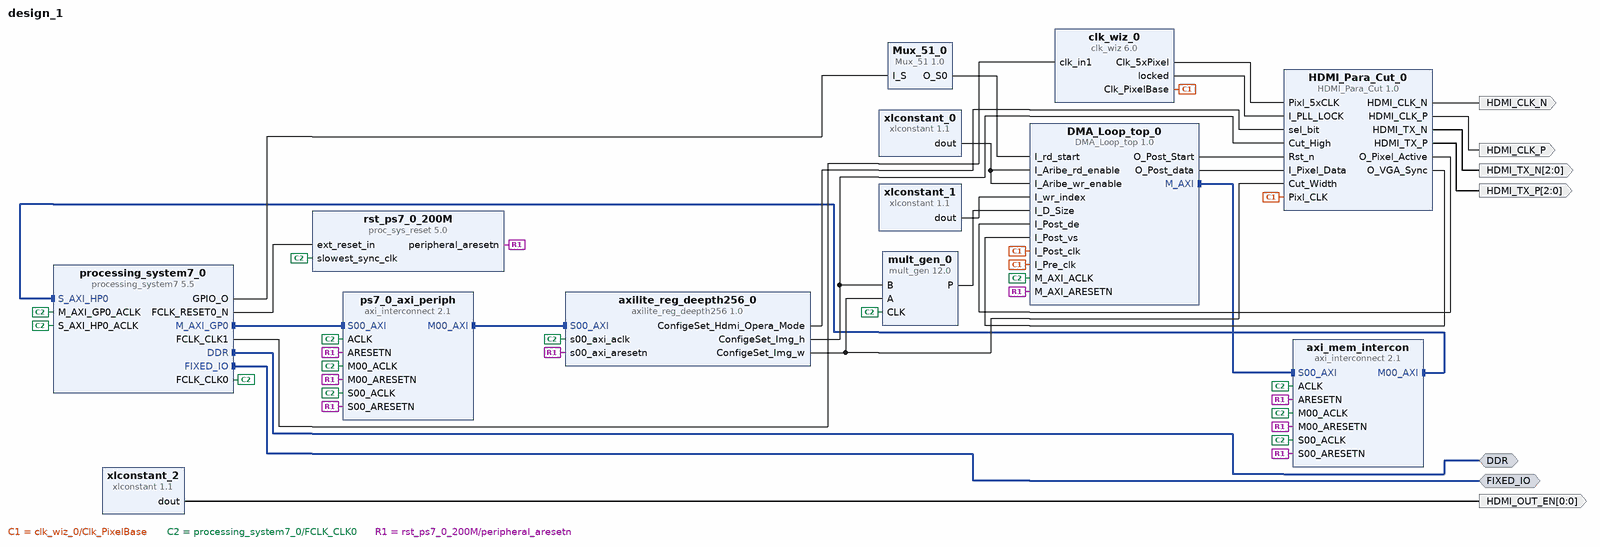
[diagram p0: block diagram of the top level]
# Vivado block design design_1, xc7z020clg400-1, Vivado 2023.2
create_bd_design design_1

create_bd_intf_port -mode Master -vlnv xilinx.com:interface:ddrx_rtl:1.0 DDR
create_bd_intf_port -mode Master -vlnv xilinx.com:display_processing_system7:fixedio_rtl:1.0 FIXED_IO
create_bd_port -dir O -type clk HDMI_CLK_P
create_bd_port -dir O -type clk HDMI_CLK_N
create_bd_port -dir O -from 2 -to 0 HDMI_TX_P
create_bd_port -dir O -from 2 -to 0 HDMI_TX_N
create_bd_port -dir O -from 0 -to 0 HDMI_OUT_EN

create_bd_cell -type ip -vlnv xilinx.com:ip:processing_system7:5.5 processing_system7_0
set_property -dict [list \
  CONFIG.PCW_ENET0_ENET0_IO {MIO 16 .. 27} \
  CONFIG.PCW_ENET0_GRP_MDIO_ENABLE 1 \
  CONFIG.PCW_ENET0_GRP_MDIO_IO {MIO 52 .. 53} \
  CONFIG.PCW_ENET0_PERIPHERAL_ENABLE 1 \
  CONFIG.PCW_EN_CLK1_PORT 1 \
  CONFIG.PCW_FCLK_CLK0_BUF FALSE \
  CONFIG.PCW_FCLK_CLK1_BUF TRUE \
  CONFIG.PCW_FPGA0_PERIPHERAL_FREQMHZ 150 \
  CONFIG.PCW_FPGA1_PERIPHERAL_FREQMHZ 100 \
  CONFIG.PCW_FPGA_FCLK1_ENABLE 1 \
  CONFIG.PCW_GPIO_EMIO_GPIO_ENABLE 1 \
  CONFIG.PCW_GPIO_EMIO_GPIO_IO 5 \
  CONFIG.PCW_GPIO_EMIO_GPIO_WIDTH 5 \
  CONFIG.PCW_PRESET_BANK1_VOLTAGE {LVCMOS 1.8V} \
  CONFIG.PCW_SD0_GRP_CD_ENABLE 0 \
  CONFIG.PCW_SD0_GRP_WP_ENABLE 0 \
  CONFIG.PCW_SD0_PERIPHERAL_ENABLE 1 \
  CONFIG.PCW_SD0_SD0_IO {MIO 40 .. 45} \
  CONFIG.PCW_SDIO_PERIPHERAL_FREQMHZ 100 \
  CONFIG.PCW_UART0_PERIPHERAL_ENABLE 1 \
  CONFIG.PCW_UART0_UART0_IO {MIO 46 .. 47} \
  CONFIG.PCW_UART_PERIPHERAL_FREQMHZ 100 \
  CONFIG.PCW_UIPARAM_DDR_PARTNO Custom \
  CONFIG.PCW_USE_S_AXI_HP0 1 \
] [get_bd_cells processing_system7_0]
# 127 more settings of processing_system7_0 are not shown: defaults, MIO pin electricals, DDR timing, and values the tool derives
create_bd_cell -type ip -vlnv xilinx.com:ip:axi_interconnect:2.1 ps7_0_axi_periph
set_property -dict {CONFIG.NUM_MI 1} [get_bd_cells ps7_0_axi_periph]
create_bd_cell -type ip -vlnv xilinx.com:ip:proc_sys_reset:5.0 rst_ps7_0_200M
create_bd_cell -type ip -vlnv xilinx.com:ip:xlconstant:1.1 xlconstant_0
create_bd_cell -type ip -vlnv xilinx.com:ip:clk_wiz:6.0 clk_wiz_0
set_property -dict [list \
  CONFIG.CLKOUT1_JITTER 221.150 \
  CONFIG.CLKOUT1_PHASE_ERROR 300.991 \
  CONFIG.CLKOUT1_REQUESTED_OUT_FREQ 108 \
  CONFIG.CLKOUT2_JITTER 178.209 \
  CONFIG.CLKOUT2_PHASE_ERROR 300.991 \
  CONFIG.CLKOUT2_REQUESTED_OUT_FREQ 540 \
  CONFIG.CLKOUT2_USED true \
  CONFIG.CLK_OUT1_PORT Clk_PixelBase \
  CONFIG.CLK_OUT2_PORT Clk_5xPixel \
  CONFIG.MMCM_CLKFBOUT_MULT_F 54.000 \
  CONFIG.MMCM_CLKOUT0_DIVIDE_F 10.000 \
  CONFIG.MMCM_CLKOUT1_DIVIDE 2 \
  CONFIG.MMCM_DIVCLK_DIVIDE 5 \
  CONFIG.NUM_OUT_CLKS 2 \
  CONFIG.PRIM_IN_FREQ 100.000 \
  CONFIG.USE_LOCKED true \
  CONFIG.USE_RESET false \
] [get_bd_cells clk_wiz_0]
create_bd_cell -type ip -vlnv xilinx.com:user:axilite_reg_deepth256:1.0 axilite_reg_deepth256_0
create_bd_cell -type ip -vlnv xilinx.com:ip:mult_gen:12.0 mult_gen_0
set_property -dict [list \
  CONFIG.Multiplier_Construction Use_Mults \
  CONFIG.PortAType Unsigned \
  CONFIG.PortAWidth 12 \
  CONFIG.PortBType Unsigned \
  CONFIG.PortBWidth 12 \
] [get_bd_cells mult_gen_0]
create_bd_cell -type ip -vlnv xilinx.com:ip:xlconstant:1.1 xlconstant_1
set_property -dict {CONFIG.CONST_VAL 2 CONFIG.CONST_WIDTH 8} [get_bd_cells xlconstant_1]
create_bd_cell -type ip -vlnv xilinx.com:user:Mux_51:1.0 Mux_51_0
create_bd_cell -type ip -vlnv xilinx.com:ip:axi_interconnect:2.1 axi_mem_intercon
set_property -dict {CONFIG.NUM_MI 1} [get_bd_cells axi_mem_intercon]
create_bd_cell -type ip -vlnv xilinx.com:ip:xlconstant:1.1 xlconstant_2
create_bd_cell -type ip -vlnv xilinx.com:user:HDMI_Para_Cut:1.0 HDMI_Para_Cut_0
set_property -dict [list \
  CONFIG.H_ActiveSize 1280 \
  CONFIG.H_FrameSize 1688 \
  CONFIG.H_SyncEnd 1440 \
  CONFIG.H_SyncStart 1328 \
  CONFIG.V_ActiveSize 1024 \
  CONFIG.V_FrameSize 1066 \
  CONFIG.V_SyncEnd 1028 \
  CONFIG.V_SyncStart 1025 \
] [get_bd_cells HDMI_Para_Cut_0]
create_bd_cell -type ip -vlnv xilinx.com:user:DMA_Loop_top:1.0 DMA_Loop_top_0
set_property -dict [list \
  CONFIG.AXI_Buff_NUM 1 \
  CONFIG.RD_Base_addr 0x05000000 \
  CONFIG.WR_Base_addr 0x02000000 \
  CONFIG.WR_CH_EN 0 \
] [get_bd_cells DMA_Loop_top_0]

# ---- connections ----

connect_bd_intf_net [get_bd_intf_pins DMA_Loop_top_0/M_AXI] [get_bd_intf_pins axi_mem_intercon/S00_AXI]
connect_bd_intf_net [get_bd_intf_pins axi_mem_intercon/M00_AXI] [get_bd_intf_pins processing_system7_0/S_AXI_HP0]
connect_bd_intf_net [get_bd_intf_ports DDR] [get_bd_intf_pins processing_system7_0/DDR]
connect_bd_intf_net [get_bd_intf_ports FIXED_IO] [get_bd_intf_pins processing_system7_0/FIXED_IO]
connect_bd_intf_net [get_bd_intf_pins processing_system7_0/M_AXI_GP0] [get_bd_intf_pins ps7_0_axi_periph/S00_AXI]
connect_bd_intf_net [get_bd_intf_pins ps7_0_axi_periph/M00_AXI] [get_bd_intf_pins axilite_reg_deepth256_0/S00_AXI]
connect_bd_net [get_bd_pins DMA_Loop_top_0/O_Post_Start] [get_bd_pins HDMI_Para_Cut_0/Rst_n]
connect_bd_net [get_bd_pins DMA_Loop_top_0/O_Post_data] [get_bd_pins HDMI_Para_Cut_0/I_Pixel_Data]
connect_bd_net [get_bd_pins HDMI_Para_Cut_0/HDMI_CLK_N] [get_bd_ports HDMI_CLK_N]
connect_bd_net [get_bd_pins HDMI_Para_Cut_0/HDMI_CLK_P] [get_bd_ports HDMI_CLK_P]
connect_bd_net [get_bd_pins HDMI_Para_Cut_0/HDMI_TX_N] [get_bd_ports HDMI_TX_N]
connect_bd_net [get_bd_pins HDMI_Para_Cut_0/HDMI_TX_P] [get_bd_ports HDMI_TX_P]
connect_bd_net [get_bd_pins HDMI_Para_Cut_0/O_Pixel_Active] [get_bd_pins DMA_Loop_top_0/I_Post_de]
connect_bd_net [get_bd_pins HDMI_Para_Cut_0/O_VGA_Sync] [get_bd_pins DMA_Loop_top_0/I_Post_vs]
connect_bd_net [get_bd_pins Mux_51_0/O_S0] [get_bd_pins DMA_Loop_top_0/I_rd_start]
connect_bd_net [get_bd_pins axilite_reg_deepth256_0/ConfigeSet_Hdmi_Opera_Mode] [get_bd_pins HDMI_Para_Cut_0/sel_bit]
connect_bd_net [get_bd_pins axilite_reg_deepth256_0/ConfigeSet_Img_h] [get_bd_pins mult_gen_0/B] [get_bd_pins HDMI_Para_Cut_0/Cut_High]
connect_bd_net [get_bd_pins axilite_reg_deepth256_0/ConfigeSet_Img_w] [get_bd_pins mult_gen_0/A] [get_bd_pins HDMI_Para_Cut_0/Cut_Width]
connect_bd_net [get_bd_pins clk_wiz_0/Clk_5xPixel] [get_bd_pins HDMI_Para_Cut_0/Pixl_5xCLK]
connect_bd_net [get_bd_pins clk_wiz_0/Clk_PixelBase] \
  [get_bd_pins HDMI_Para_Cut_0/Pixl_CLK] [get_bd_pins DMA_Loop_top_0/I_Pre_clk] [get_bd_pins DMA_Loop_top_0/I_Post_clk]
connect_bd_net [get_bd_pins clk_wiz_0/locked] [get_bd_pins HDMI_Para_Cut_0/I_PLL_LOCK]
connect_bd_net [get_bd_pins mult_gen_0/P] [get_bd_pins DMA_Loop_top_0/I_D_Size]
connect_bd_net [get_bd_pins processing_system7_0/FCLK_CLK0] \
  [get_bd_pins processing_system7_0/M_AXI_GP0_ACLK] [get_bd_pins processing_system7_0/S_AXI_HP0_ACLK] \
  [get_bd_pins axi_mem_intercon/ACLK] [get_bd_pins axi_mem_intercon/S00_ACLK] [get_bd_pins axi_mem_intercon/M00_ACLK] \
  [get_bd_pins mult_gen_0/CLK] [get_bd_pins ps7_0_axi_periph/ACLK] [get_bd_pins ps7_0_axi_periph/S00_ACLK] \
  [get_bd_pins ps7_0_axi_periph/M00_ACLK] [get_bd_pins rst_ps7_0_200M/slowest_sync_clk] \
  [get_bd_pins axilite_reg_deepth256_0/s00_axi_aclk] [get_bd_pins DMA_Loop_top_0/M_AXI_ACLK]
connect_bd_net [get_bd_pins processing_system7_0/FCLK_CLK1] [get_bd_pins clk_wiz_0/clk_in1]
connect_bd_net [get_bd_pins processing_system7_0/FCLK_RESET0_N] [get_bd_pins rst_ps7_0_200M/ext_reset_in]
connect_bd_net [get_bd_pins processing_system7_0/GPIO_O] [get_bd_pins Mux_51_0/I_S]
connect_bd_net [get_bd_pins rst_ps7_0_200M/peripheral_aresetn] \
  [get_bd_pins axi_mem_intercon/ARESETN] [get_bd_pins axi_mem_intercon/S00_ARESETN] \
  [get_bd_pins axi_mem_intercon/M00_ARESETN] [get_bd_pins ps7_0_axi_periph/ARESETN] \
  [get_bd_pins ps7_0_axi_periph/S00_ARESETN] [get_bd_pins ps7_0_axi_periph/M00_ARESETN] \
  [get_bd_pins axilite_reg_deepth256_0/s00_axi_aresetn] [get_bd_pins DMA_Loop_top_0/M_AXI_ARESETN]
connect_bd_net [get_bd_pins xlconstant_0/dout] [get_bd_pins DMA_Loop_top_0/I_Aribe_wr_enable] [get_bd_pins DMA_Loop_top_0/I_Aribe_rd_enable]
connect_bd_net [get_bd_pins xlconstant_1/dout] [get_bd_pins DMA_Loop_top_0/I_wr_index]
connect_bd_net [get_bd_pins xlconstant_2/dout] [get_bd_ports HDMI_OUT_EN]

# ---- address map ----
assign_bd_address -offset 0x00000000 -range 512M -target_address_space [get_bd_addr_spaces DMA_Loop_top_0/M_AXI] [get_bd_addr_segs processing_system7_0/S_AXI_HP0/HP0_DDR_LOWOCM]
assign_bd_address -offset 0x43C00000 -range 64K -target_address_space [get_bd_addr_spaces processing_system7_0/Data] [get_bd_addr_segs axilite_reg_deepth256_0/S00_AXI/S00_AXI_reg]

validate_bd_design
save_bd_design
